# Altium schematic sheet 200MHz_Comb_Gen_Driver.SchDoc: 200MHz_Comb_Gen_Driver
size D; Date: 09-24-10; DrawnBy: C. Lewis; Engineer: C. Lewis; Address1: 4650 NORRIS CANYON RD.; Address2: SAN RAMON, CA 94583; DocumentNumber: 35133; Revision: D; SheetNumber: 10; SheetTotal: 20; PageSetup: Record=PageOptions|CenterHorizontal=True|CenterVertical=True|PrintScale=0.51|XCorrection=1.00|YCorrection=1.00|PrintKind=1|BorderSize=5000000|LeftOffset=0|BottomOffset=0|Orientation=2|PaperLength=1000|PaperWidth=1000|Scale=100|PaperSource=15|PrintQuality=600|MediaType=1|DitherType=10|PaperKind=11x17|PrintScaleMode=1; DocumentName: Sheet1.SCHDOC; ModifiedDate: 10-27-11
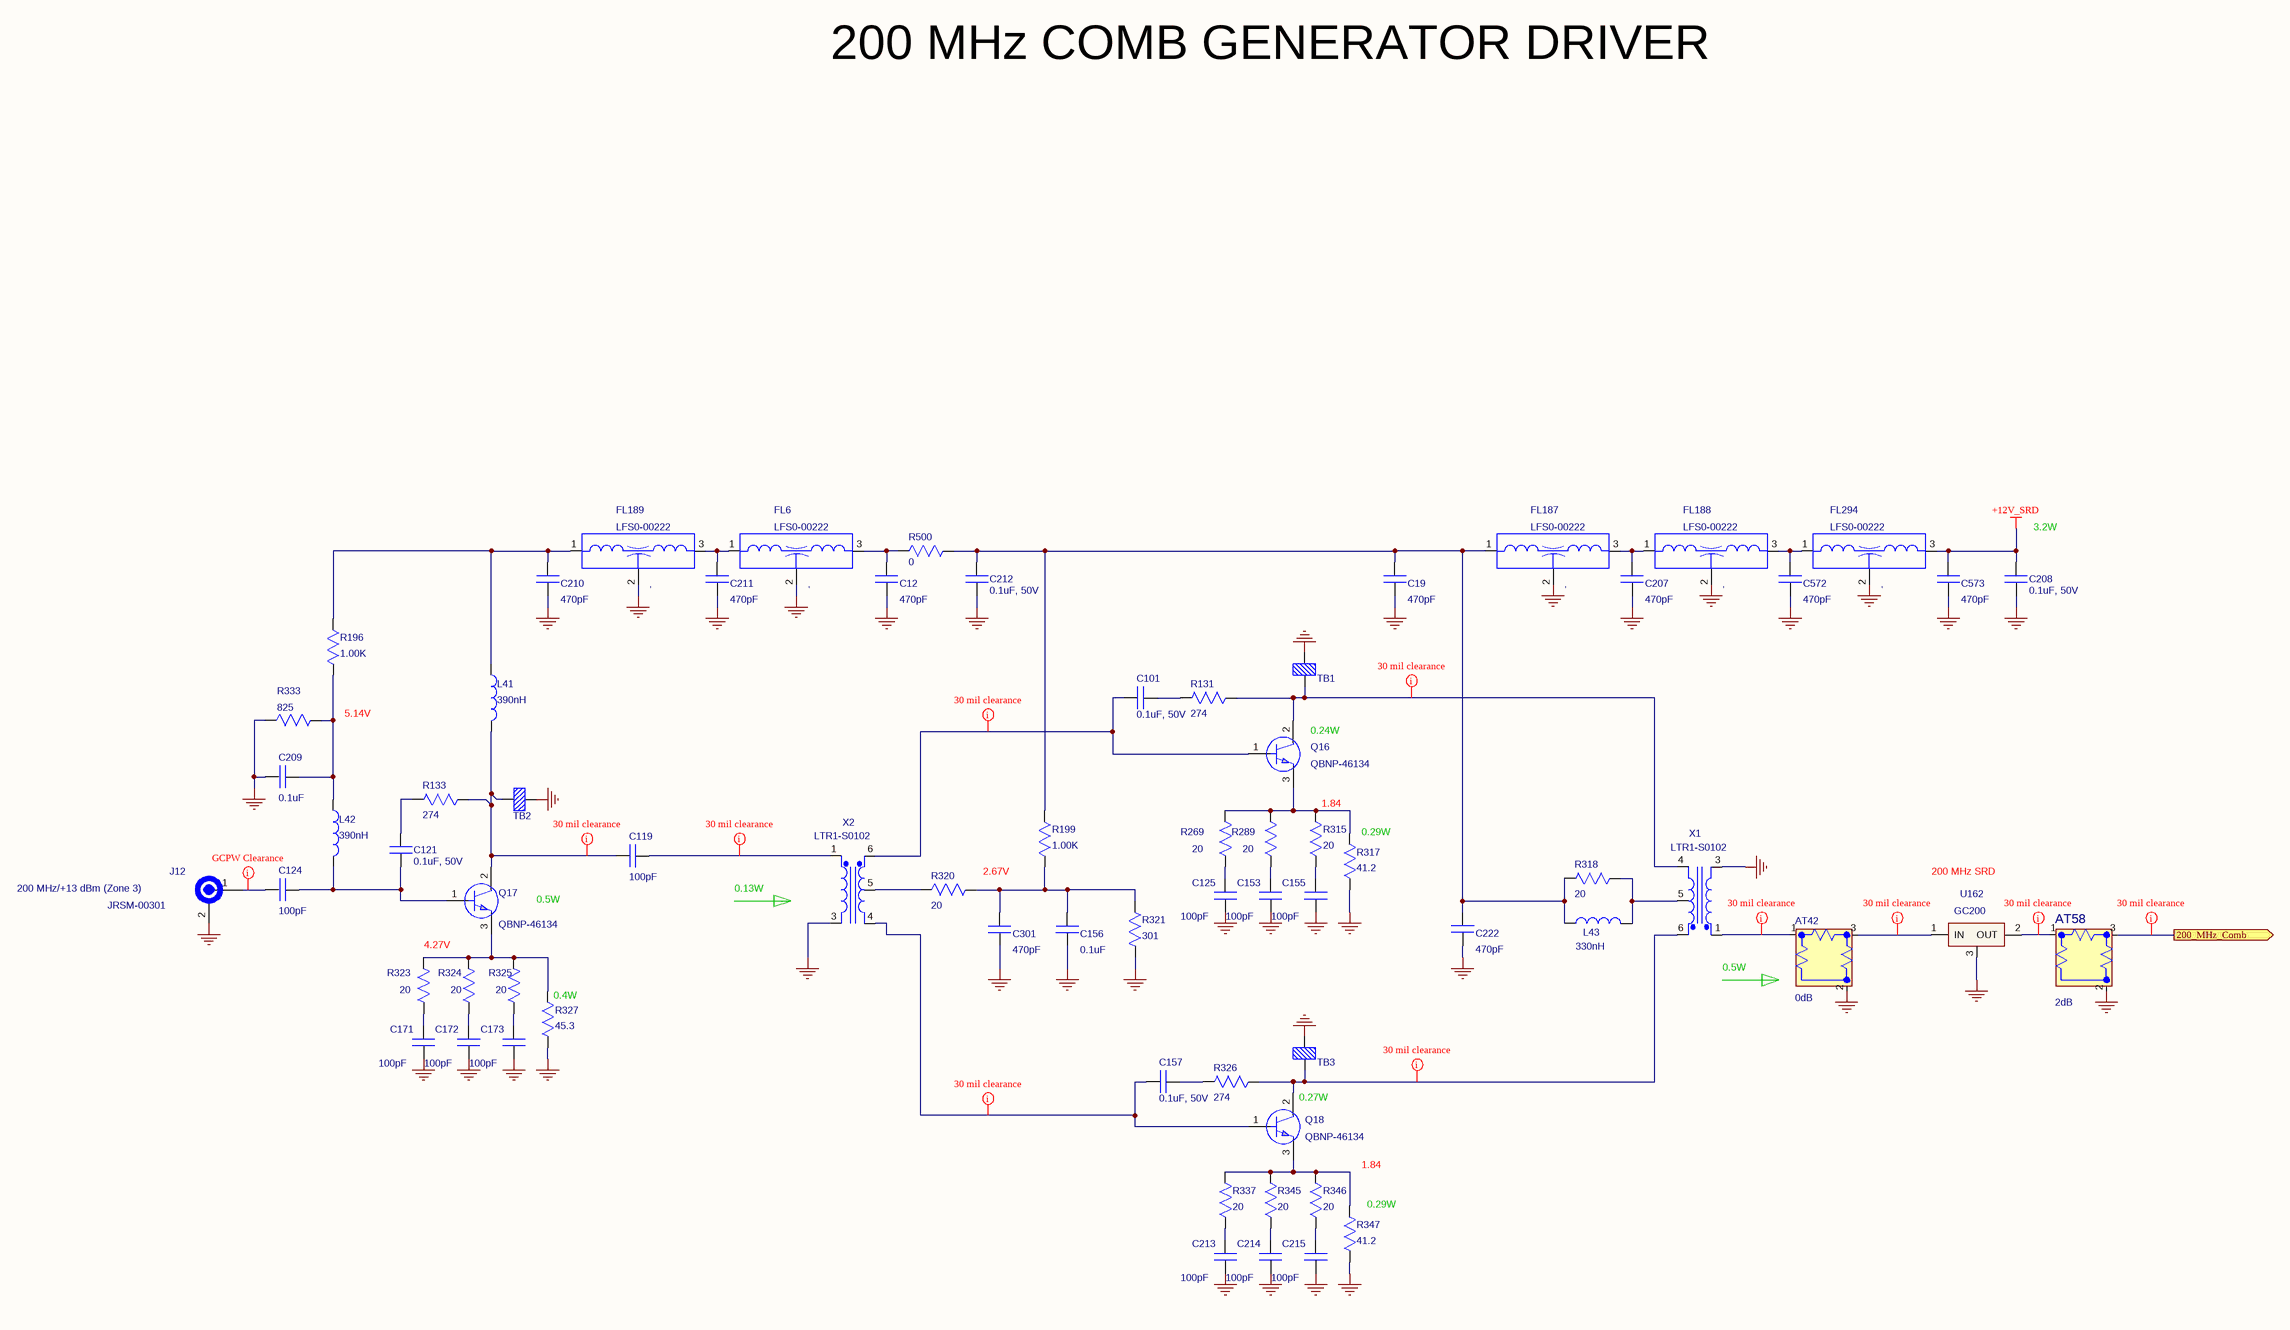
[diagram p0: 200MHz_Comb_Gen_Driver.SchDoc]

## Parts
AT42  value 0dB  [ATTN-IMS-0805]  (hidden comment: PAD;CHIP;0dB;+/-.3dB;.08 x .05;50 OHM;FACE DOWN)
AT58  value 2dB  [ATTN-IMS-0805]  (hidden comment: PAD;CHIP;2dB;+/-.3dB;.08 x .05;50 OHM;FACE DOWN)
C12  value 470pF  [CAP-0402-N]  (hidden comment: 470 PF;5%;COG;>50V;CHIP;0402)
C19  value 470pF  [CAP-0402-N]  (hidden comment: 470 PF;5%;COG;>50V;CHIP;0402)
C101  value 0.1uF, 50V  [CAP-0603-N]  (hidden comment: .1UF;5%;X7R;50V;CHIP;0603)
C119  value 100pF  [CAP-0402-N]  (hidden comment: 100 PF;5%;COG;>50V;CHIP;0402)
C121  value 0.1uF, 50V  [CAP-0603-N]  (hidden comment: .1UF;5%;X7R;50V;CHIP;0603)
C124  value 100pF  [CAP-0402-N]  (hidden comment: 100 PF;5%;COG;>50V;CHIP;0402)
C125  value 100pF  [CAP-0402-N]  (hidden comment: 100 PF;5%;COG;>50V;CHIP;0402)
C153  value 100pF  [CAP-0402-N]  (hidden comment: 100 PF;5%;COG;>50V;CHIP;0402)
C155  value 100pF  [CAP-0402-N]  (hidden comment: 100 PF;5%;COG;>50V;CHIP;0402)
C156  value 0.1uF  [CAP-0402-N]  (hidden comment: .1 UF,10%;X7R;16V,CHIP;0402)
C157  value 0.1uF, 50V  [CAP-0603-N]  (hidden comment: .1UF;5%;X7R;50V;CHIP;0603)
C171  value 100pF  [CAP-0402-N]  (hidden comment: 100 PF;5%;COG;>50V;CHIP;0402)
C172  value 100pF  [CAP-0402-N]  (hidden comment: 100 PF;5%;COG;>50V;CHIP;0402)
C173  value 100pF  [CAP-0402-N]  (hidden comment: 100 PF;5%;COG;>50V;CHIP;0402)
C207  value 470pF  [CAP-0402-N]  (hidden comment: 470 PF;5%;COG;>50V;CHIP;0402)
C208  value 0.1uF, 50V  [CAP-0603-N]  (hidden comment: .1UF;5%;X7R;50V;CHIP;0603)
C209  value 0.1uF  [CAP-0402-N]  (hidden comment: .1 UF,10%;X7R;16V,CHIP;0402)
C210  value 470pF  [CAP-0402-N]  (hidden comment: 470 PF;5%;COG;>50V;CHIP;0402)
C211  value 470pF  [CAP-0402-N]  (hidden comment: 470 PF;5%;COG;>50V;CHIP;0402)
C212  value 0.1uF, 50V  [CAP-0603-N]  (hidden comment: .1UF;5%;X7R;50V;CHIP;0603)
C213  value 100pF  [CAP-0402-N]  (hidden comment: 100 PF;5%;COG;>50V;CHIP;0402)
C214  value 100pF  [CAP-0402-N]  (hidden comment: 100 PF;5%;COG;>50V;CHIP;0402)
C215  value 100pF  [CAP-0402-N]  (hidden comment: 100 PF;5%;COG;>50V;CHIP;0402)
C222  value 470pF  [CAP-0402-N]  (hidden comment: 470 PF;5%;COG;>50V;CHIP;0402)
C301  value 470pF  [CAP-0402-N]  (hidden comment: 470 PF;5%;COG;>50V;CHIP;0402)
C572  value 470pF  [CAP-0402-N]  (hidden comment: 470 PF;5%;COG;>50V;CHIP;0402)
C573  value 470pF  [CAP-0402-N]  (hidden comment: 470 PF;5%;COG;>50V;CHIP;0402)
FL6  Filter EMI 2200PF,1206  [FIL-NFE31P-1206-4P]  (value not drawn)
FL187  Filter EMI 2200PF,1206  [FIL-NFE31P-1206-4P]  (value not drawn)
FL188  Filter EMI 2200PF,1206  [FIL-NFE31P-1206-4P]  (value not drawn)
FL189  Filter EMI 2200PF,1206  [FIL-NFE31P-1206-4P]  (value not drawn)
FL294  Filter EMI 2200PF,1206  [FIL-NFE31P-1206-4P]  (value not drawn)
J12  200 MHz/+13 dBm (Zone 3)  [CONN-3211-60035_plane_cutout]
L41  value 390nH  [IND-0603CS]  (hidden comment: INDUCTOR;390NH;5%;.78GHZ SRF;25Q;4.35 DCR;100MA;WIREWOUND;0603)
L42  value 390nH  [IND-0603CS]  (hidden comment: INDUCTOR;390NH;5%;.78GHZ SRF;25Q;4.35 DCR;100MA;WIREWOUND;0603)
L43  value 330nH  [IND-1008CS]  (hidden comment: INDUCTOR;.33 UH;5%;570 MHZ SRF;45Q @100MHZ;1.05 DCR;450MA;WIREWOUND;1008)
Q16  .  [SOT89-3N]  (value not drawn)
Q17  .  [SOT89-3N]  (value not drawn)
Q18  .  [SOT89-3N]  (value not drawn)
R131  value 274  [RES-0402-N]  (hidden comment: 274 OHMS; 1%; .1W; 100PPM; FILM; CHIP; 0402)
R133  value 274  [RES-0402-N]  (hidden comment: 274 OHMS; 1%; .1W; 100PPM; FILM; CHIP; 0402)
R196  value 1.00K  [RES-0402-N]  (hidden comment: 1.0K OHMS;.06W;1%;200PPM;FILM;CHIP;0402)
R199  value 1.00K  [RES-0402-N]  (hidden comment: 1.0K OHMS;.06W;1%;200PPM;FILM;CHIP;0402)
R269  value 20  [RES-0402-N]  (hidden comment: 20 OHMS;.06W;1%;200PPM;FILM;CHIP;0402)
R289  value 20  [RES-0402-N]  (hidden comment: 20 OHMS;.06W;1%;200PPM;FILM;CHIP;0402)
R315  value 20  [RES-0402-N]  (hidden comment: 20 OHMS;.06W;1%;200PPM;FILM;CHIP;0402)
R317  value 41.2  [RES-2010-N]  (hidden comment: 41.2 OHMS;.75W;1%;100PPM;THICK FILM;CHIP;2010;RoHS)
R318  value 20  [RES-0402-N]  (hidden comment: 20 OHMS;.06W;1%;200PPM;FILM;CHIP;0402)
R320  value 20  [RES-0402-N]  (hidden comment: 20 OHMS;.06W;1%;200PPM;FILM;CHIP;0402)
R321  value 301  [RES-0402-N]  (hidden comment: 301 OHMS; 1%; .1W; 100PPM; FILM; CHIP; 0402)
R323  value 20  [RES-0402-N]  (hidden comment: 20 OHMS;.06W;1%;200PPM;FILM;CHIP;0402)
R324  value 20  [RES-0402-N]  (hidden comment: 20 OHMS;.06W;1%;200PPM;FILM;CHIP;0402)
R325  value 20  [RES-0402-N]  (hidden comment: 20 OHMS;.06W;1%;200PPM;FILM;CHIP;0402)
R326  value 274  [RES-0402-N]  (hidden comment: 274 OHMS; 1%; .1W; 100PPM; FILM; CHIP; 0402)
R327  value 45.3  [RES-2010-N]  (hidden comment: 45.3 OHMS;0.75W;1%;100PPM;THICK FILM;CHIP;2010;RoHS)
R333  value 825  [RES-0402-N]  (hidden comment: 825 OHMS; 1%; .1W; 100PPM; FILM; CHIP; 0402)
R337  value 20  [RES-0402-N]  (hidden comment: 20 OHMS;.06W;1%;200PPM;FILM;CHIP;0402)
R345  value 20  [RES-0402-N]  (hidden comment: 20 OHMS;.06W;1%;200PPM;FILM;CHIP;0402)
R346  value 20  [RES-0402-N]  (hidden comment: 20 OHMS;.06W;1%;200PPM;FILM;CHIP;0402)
R347  value 41.2  [RES-2010-N]  (hidden comment: 41.2 OHMS;.75W;1%;100PPM;THICK FILM;CHIP;2010;RoHS)
R500  value 0  [RES-0402-N]  (hidden comment: JUMPER;0 OHMS;SMT;0402)
TB1  THERMAL BRIDGE, AlN, 1010  [TB-1010-N]  (value not drawn)
TB2  THERMAL BRIDGE, AlN, 1010  [TB-1010-N]  (value not drawn)
TB3  THERMAL BRIDGE, AlN, 1010  [TB-1010-N]  (value not drawn)
U162  M_PN: GC200  [DIO-GC-OUTLINE-L]  (hidden comment: DIODE;SRD;COAXIAL;200MHz COM GEN)
X1  XFORMER;1:2Z CT;8-600 MHZ;1W;30MA;CD542 CASE  [XFMR-CD542]  (value not drawn)
X2  XFORMER;1:2Z CT;8-600 MHZ;1W;30MA;CD542 CASE  [XFMR-CD542]  (value not drawn)

## Ports
200_MHz_Comb

## Nets
+12V_SRD: C208.1 C573.1 FL294.3(OUT)
GND: AT42.2(GND) AT58.2(GND) C12.2 C19.2 C125.1 C153.1 C155.1 C156.1 C171.1 C172.1 C173.1 C207.2 C208.2 C209.2 C210.2 C211.2 C212.2 C213.1 C214.1 C215.1 C222.2 C301.1 C572.2 C573.2 FL6.2(GND) FL187.2(GND) FL188.2(GND) FL189.2(GND) FL294.2(GND) J12.2(GND) R317.2 R321.1 R327.2 R333.2 R347.2 TB1.2 TB2.2 TB3.2 U162.3(GND) X1.3(Pri-) X2.3(Pri-)
200_MHz_Comb: AT58.3(IN/OUT) ; port 200_MHz_Comb
NetAT42_1: AT42.1(IN/OUT) X1.1(Pri+)
NetAT42_3: AT42.3(IN/OUT) U162.1(IN)
NetAT58_1: AT58.1(IN/OUT) U162.2(OUT)
NetC12_1: C12.1 FL6.3(OUT) R500.2
NetC19_1: C19.1 C212.1 C222.1 FL187.1(IN) L43.1 R199.2 R318.1 R500.1
NetC101_1: C101.1 Q16.1(BASE) X2.6(Sec+)
NetC101_2: C101.2 R131.1
NetC119_1: C119.1 X2.1(Pri+)
NetC119_2: C119.2 L41.2 Q17.2(COLLECTOR) R133.2 TB2.1
NetC121_1: C121.1 R133.1
NetC121_2: C121.2 C124.1 L42.2 Q17.1(BASE)
NetC124_2: C124.2 J12.1
NetC125_2: C125.2 R269.2
NetC153_2: C153.2 R289.2
NetC155_2: C155.2 R315.2
NetC156_2: C156.2 C301.2 R199.1 R320.1 R321.2
NetC157_1: C157.1 Q18.1(BASE) X2.4(Sec-)
NetC157_2: C157.2 R326.1
NetC171_2: C171.2 R323.2
NetC172_2: C172.2 R324.2
NetC173_2: C173.2 R325.2
NetC207_1: C207.1 FL187.3(OUT) FL188.1(IN)
NetC209_1: C209.1 L42.1 R196.1 R333.1
NetC210_1: C210.1 FL189.1(IN) L41.1 R196.2
NetC211_1: C211.1 FL6.1(IN) FL189.3(OUT)
NetC213_2: C213.2 R337.2
NetC214_2: C214.2 R345.2
NetC215_2: C215.2 R346.2
NetC572_1: C572.1 FL188.3(OUT) FL294.1(IN)
NetL43_2: L43.2 R318.2 X1.5(SecCT)
NetQ16_2: Q16.2(COLLECTOR) R131.2 TB1.1 X1.4(Sec-)
NetQ16_3: Q16.3(EMITTER) R269.1 R289.1 R315.1 R317.1
NetQ17_3: Q17.3(EMITTER) R323.1 R324.1 R325.1 R327.1
NetQ18_2: Q18.2(COLLECTOR) R326.2 TB3.1 X1.6(Sec+)
NetQ18_3: Q18.3(EMITTER) R337.1 R345.1 R346.1 R347.1
NetR320_2: R320.2 X2.5(SecCT)

## Layout directives
net class 30 mil clearance: 200_MHz_Comb, NetAT42_1, NetAT42_3, NetAT58_1, NetC101_1, NetC119_1, NetC119_2, NetC157_1, NetQ16_2, NetQ18_2
net class GCPW Clearance: NetC124_2

## Notes on the sheet
- 200 MHz COMB GENERATOR DRIVER
- (near C208) 3.2W
- 5.14V
- (near Q16) 0.24W
- (near R315) 1.84
- (near R320) 2.67V
- (near R317) 0.29W
- 200 MHz SRD
- 0.5W
- 0.13W
- 4.27V
- (near X1) 0.5W
- (near R327) 0.4W
- (near Q18) 0.27W
- 1.84
- (near R347) 0.29W
- Title
- Sheet Title
- PRINTED DOCUMENT IS CONSIDERED UNCONTROLLED. VERIFY REVISION IN PLM SYSTEM.
- THIS DOCUMENT CONTAINS PROPRIETARY INFORMATION. DESIGN RIGHTS BELONG TO GIGA-TRONICS AND MAY NOT BE REPRODUCED WITHOUT WRITTEN AUTHORIZATION FOR ANY REASON EXCEPT CALIBRATION, OPERATION AND MAINTENANCE.
- Size
- CAGE CODE
- Filename
- D
- Document Number
- 58900
- Date
- Sheet
- Rev
- of
- (in symbol LFS0-00222) ,

## Library data of the parts
AT42 = MPFC-A1000: NoLoad: .; Approved: CL; M_PN: IMS1141-00DB; MFGR: IMS RESISTORS; level: 1; line_number: 50; ModifyDate: 4/16/13; G_PN: MPFC-A1000; item_number: MPFC-A1000
AT58 = MPFC-A1002: NoLoad: .; Approved: CL; M_PN: IMS1141-02DB; MFGR: IMS RESISTORS; level: 1; line_number: 10; ModifyDate: 3/8/13; G_PN: MPFC-A1002; item_number: MPFC-A1002
C12 C19 C210 C211 = CK40-01470: Approved: CL; MFGR: Any; NoLoad: .; level: 1; line_number: 75; ModifyDate: 02/22/12; G_PN: CK40-01470; M_PN: Any; item_number: CK40-01470
C101 C121 C157 C212 = CK45-14100: Approved: CL; NoLoad: .; MFGR: VENKEL; M_PN: C0603X7R500-104JNE; level: 1; line_number: 65; G_PN: CK45-14100; ModifyDate: 3/29/13; item_number: CK45-14100
C119 C124 C125 C153 C155 C171-C173 C213-C215 = CK40-01100: MFGR: Any; Approved: CL; NoLoad: .; level: 1; line_number: 70; ModifyDate: 3/21/12; M_PN: Any; G_PN: CK40-01100; item_number: CK40-01100
C156 C209 = CK40-04100: Approved: CL; NoLoad: .; MFGR: VENKEL; M_PN: C0402X7R160-104KNP; level: 1; line_number: 95; G_PN: CK40-04100; ModifyDate: 3/29/13; item_number: CK40-04100
C207 C222 C572 C573 = CK40-01470: Approved: CL; NoLoad: .; MFGR: Any; level: 1; line_number: 75; G_PN: CK40-01470; ModifyDate: 02/22/12; M_PN: Any; item_number: CK40-01470
C208 = CK45-14100: Approved: CL; NoLoad: .; M_PN: C0603X7R500-104JNE; MFGR: VENKEL; level: 1; line_number: 65; ModifyDate: 3/29/13; G_PN: CK45-14100; item_number: CK45-14100
C301 = CK40-01470: MFGR: Any; Approved: CL; NoLoad: .; level: 1; line_number: 75; ModifyDate: 02/22/12; M_PN: Any; G_PN: CK40-01470; item_number: CK40-01470
FL6 FL187-FL189 FL294 = LFS0-00222: Approved: CL; NoLoad: .; M_PN: NFE31PT222Z1E9BL; MFGR: MURATA; level: 1; line_number: 335; G_PN: LFS0-00222; ModifyDate: 02/22/12; Value: 2200pF; item_number: LFS0-00222
J12 = JRSM-00301: SMPM;SB EDGE LAUNCH;MALE;1 PORT; Value: 3211-60035; MFGR: SV MICROWAVE; Approved: CL; NoLoad: .; level: 1; line_number: 485; M_PN: 3211-60035; ModifyDate: 5/14/12; G_PN: JRSM-00301; item_number: JRSM-00301
L41 L42 = LSA3-04390: M_PN: 0603CS-R39XJLU; NoLoad: .; Approved: CL; MFGR: COILCRAFT; level: 1; line_number: 580; G_PN: LSA3-04390; ModifyDate: 02/22/12; item_number: LSA3-04390
L43 = LSA1-04330: M_PN: 1008CS-331XJLB; NoLoad: .; Approved: CL; MFGR: COILCRAFT; level: 1; line_number: 585; G_PN: LSA1-04330; ModifyDate: 02/22/12; item_number: LSA1-04330
Q16-Q18 = QBNP-46134: 27.5 dBm @1GHz;5.5 GHz fT;15V MAX;250 mA MAX;SOT-89; Value: MMBR941LT1; MFGR: CEL; Approved: NM; M_PN: NE46134; level: 1; line_number: 635; G_PN: QBNP-46134; NoLoad: .; ModifyDate: 11/28/12; item_number: QBNP-46134
R131 R133 R326 = RK35-02740: Approved: CL; NoLoad: .; MFGR: ANY; level: 1; line_number: 695; G_PN: RK35-02740; ModifyDate: 6/28/13; M_PN: ANY; item_number: RK35-02740
R196 R199 = RK35-11000: NoLoad: .; MFGR: ANY; Approved: CL; level: 1; line_number: 1025; ModifyDate: 02/22/12; M_PN: ANY; G_PN: RK35-11000; item_number: RK35-11000
R269 R289 R315 R320 R323-R325 R337 R345 R346 = RK35-00200: NoLoad: .; Approved: CL; MFGR: ANY; level: 1; line_number: 780; G_PN: RK35-00200; ModifyDate: 02/22/12; M_PN: ANY; item_number: RK35-00200
R317 R347 = RK65-00412: NoLoad: .; M_PN: CRCW201041R2FKEF; MFGR: VISHAY/DALE; Approved: CL; level: 1; line_number: 830; G_PN: RK65-00412; ModifyDate: 3/18/12; item_number: RK65-00412
R318 = RK35-00200: Approved: CL; NoLoad: .; MFGR: ANY; level: 1; line_number: 780; G_PN: RK35-00200; ModifyDate: 02/22/12; M_PN: ANY; item_number: RK35-00200
R321 = RK35-03010: Approved: CL; NoLoad: .; MFGR: ANY; level: 1; line_number: 835; ModifyDate: 4/12/12; G_PN: RK35-03010; M_PN: ANY; item_number: RK35-03010
R327 = RK65-00453: NoLoad: .; M_PN: CRCW201045R3FKEF; MFGR: VISHAY/DALE; Approved: CL; level: 1; line_number: 890; G_PN: RK65-00453; ModifyDate: 02/22/12; item_number: RK65-00453
R333 = RK35-08250: Approved: CL; NoLoad: .; MFGR: ANY; level: 1; line_number: 855; ModifyDate: 02/22/12; G_PN: RK35-08250; M_PN: ANY; item_number: RK35-08250
R500 = RK35-00000: NoLoad: .; Approved: CL; MFGR: ANY; level: 1; line_number: 1005; G_PN: RK35-00000; ModifyDate: 02/22/12; M_PN: ANY; item_number: RK35-00000
TB1-TB3 = BK51-00000: Approved: CL; NoLoad: .; MFGR: ANY; M_PN: BT31010WA; level: 1; line_number: 1090; G_PN: BK51-00000; ModifyDate: 6-28-13; Value: N/A; item_number: BK51-00000
U162 = DIA0-00200: Approved: NM; NoLoad: .; MFGR: HEROTEK; level: 1; line_number: 1140; G_PN: DIA0-00200; ModifyDate: 1/23/2013; item_number: DIA0-00200
X1 X2 = LTR1-S0102: M_PN: ADT2-1T-1P+; NoLoad: .; MFGR: MINICIRCUITS; Approved: NM; Value: ADT2-1T-1P+; level: 1; line_number: 1070; ModifyDate: 11/9/12; G_PN: LTR1-S0102; item_number: LTR1-S0102